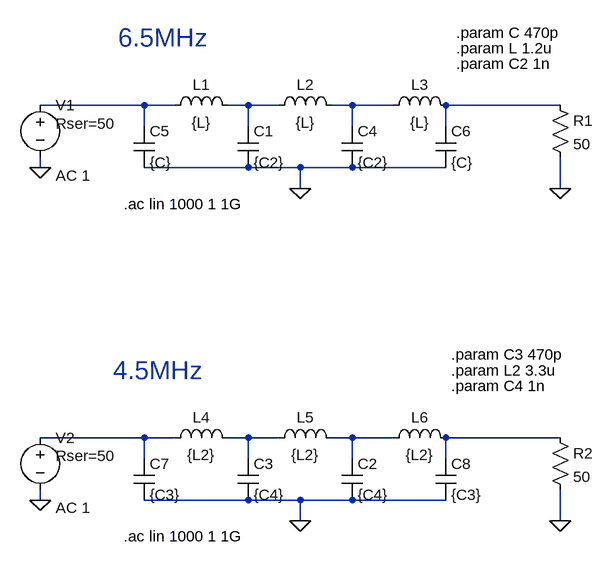
[diagram p0: schematic Low_Pass_Filters.asc]
Low_Pass_Filters.asc, the LTspice schematic file:
Version 4
SHEET 1 880 856
WIRE 32 176 -128 176
WIRE 80 176 32 176
WIRE 192 176 160 176
WIRE 240 176 192 176
WIRE 352 176 320 176
WIRE 416 176 352 176
WIRE 672 176 496 176
WIRE 32 208 32 176
WIRE 192 208 192 176
WIRE 352 208 352 176
WIRE 496 208 496 176
WIRE -128 272 -128 256
WIRE 192 272 32 272
WIRE 272 272 192 272
WIRE 352 272 272 272
WIRE 496 272 352 272
WIRE 272 304 272 272
WIRE 672 304 672 256
WIRE 32 688 -128 688
WIRE 80 688 32 688
WIRE 192 688 160 688
WIRE 240 688 192 688
WIRE 352 688 320 688
WIRE 416 688 352 688
WIRE 672 688 496 688
WIRE 32 720 32 688
WIRE 192 720 192 688
WIRE 352 720 352 688
WIRE 496 720 496 688
WIRE -128 784 -128 768
WIRE 192 784 32 784
WIRE 272 784 192 784
WIRE 352 784 272 784
WIRE 496 784 352 784
WIRE 272 816 272 784
WIRE 672 816 672 768
FLAG 272 304 0
FLAG -128 272 0
FLAG 672 304 0
FLAG 272 816 0
FLAG -128 784 0
FLAG 672 816 0
SYMBOL ind 64 192 R270
WINDOW 0 32 56 VTop 2
WINDOW 3 5 56 VBottom 2
SYMATTR InstName L1
SYMATTR Value {L}
SYMBOL ind 224 192 R270
WINDOW 0 32 56 VTop 2
WINDOW 3 5 56 VBottom 2
SYMATTR InstName L2
SYMATTR Value {L}
SYMBOL ind 400 192 R270
WINDOW 0 32 56 VTop 2
WINDOW 3 5 56 VBottom 2
SYMATTR InstName L3
SYMATTR Value {L}
SYMBOL cap 336 208 R0
SYMATTR InstName C4
SYMATTR Value {C2}
SYMBOL cap 176 208 R0
SYMATTR InstName C1
SYMATTR Value {C2}
SYMBOL cap 16 208 R0
SYMATTR InstName C5
SYMATTR Value {C}
SYMBOL cap 480 208 R0
SYMATTR InstName C6
SYMATTR Value {C}
SYMBOL res 656 160 R0
SYMATTR InstName R1
SYMATTR Value 50
SYMBOL voltage -128 160 R0
WINDOW 123 24 124 Left 2
WINDOW 39 24 44 Left 2
SYMATTR Value2 AC 1
SYMATTR SpiceLine Rser=50
SYMATTR InstName V1
SYMATTR Value ""
SYMBOL ind 64 704 R270
WINDOW 0 32 56 VTop 2
WINDOW 3 5 56 VBottom 2
SYMATTR InstName L4
SYMATTR Value {L2}
SYMBOL ind 224 704 R270
WINDOW 0 32 56 VTop 2
WINDOW 3 5 56 VBottom 2
SYMATTR InstName L5
SYMATTR Value {L2}
SYMBOL ind 400 704 R270
WINDOW 0 32 56 VTop 2
WINDOW 3 5 56 VBottom 2
SYMATTR InstName L6
SYMATTR Value {L2}
SYMBOL cap 336 720 R0
SYMATTR InstName C2
SYMATTR Value {C4}
SYMBOL cap 176 720 R0
SYMATTR InstName C3
SYMATTR Value {C4}
SYMBOL cap 16 720 R0
SYMATTR InstName C7
SYMATTR Value {C3}
SYMBOL cap 480 720 R0
SYMATTR InstName C8
SYMATTR Value {C3}
SYMBOL res 656 672 R0
SYMATTR InstName R2
SYMATTR Value 50
SYMBOL voltage -128 672 R0
WINDOW 123 24 124 Left 2
WINDOW 39 24 44 Left 2
SYMATTR Value2 AC 1
SYMATTR SpiceLine Rser=50
SYMATTR InstName V2
SYMATTR Value ""
TEXT 0 328 Left 2 !.ac lin 1000 1 1G
TEXT 512 64 Left 2 !.param C 470p
TEXT 512 88 Left 2 !.param L 1.2u
TEXT 512 112 Left 2 !.param C2 1n
TEXT -8 72 Left 4 ;6.5MHz
TEXT 0 840 Left 2 !.ac lin 1000 1 1G
TEXT 504 560 Left 2 !.param C3 470p
TEXT 504 584 Left 2 !.param L2 3.3u
TEXT 504 608 Left 2 !.param C4 1n
TEXT -16 584 Left 4 ;4.5MHz

The netlist it stands for:
* Low_Pass_Filters.asc
L1 N001 N002 {L}
L2 N002 N003 {L}
L3 N003 N004 {L}
C4 N003 0 {C2}
C1 N002 0 {C2}
C5 N001 0 {C}
C6 N004 0 {C}
R1 N004 0 50
V1 N001 0 AC 1 Rser=50
L4 N005 N006 {L2}
L5 N006 N007 {L2}
L6 N007 N008 {L2}
C2 N007 0 {C4}
C3 N006 0 {C4}
C7 N005 0 {C3}
C8 N008 0 {C3}
R2 N008 0 50
V2 N005 0 AC 1 Rser=50
.ac lin 1000 1 1G
.param C 470p
.param L 1.2u
.param C2 1n
* 6.5MHz
.ac lin 1000 1 1G
.param C3 470p
.param L2 3.3u
.param C4 1n
* 4.5MHz
.backanno
.end